# Altium schematic sheet TELEM_IF.SchDoc
size 420 x 297 mm; SheetNumber: 6; PageSetup: Record=PageOptions|CenterHorizontal=False|CenterVertical=False|PrintScale=0.95|XCorrection=0.00|YCorrection=0.00|PrintKind=1|BorderSize=5000000|LeftOffset=0|BottomOffset=0|Orientation=1|PaperLength=1000|PaperWidth=1000|Scale=100|PaperSource=15|PrintQuality=600|MediaType=1|DitherType=10|PaperKind=A4|PrintScaleMode=1
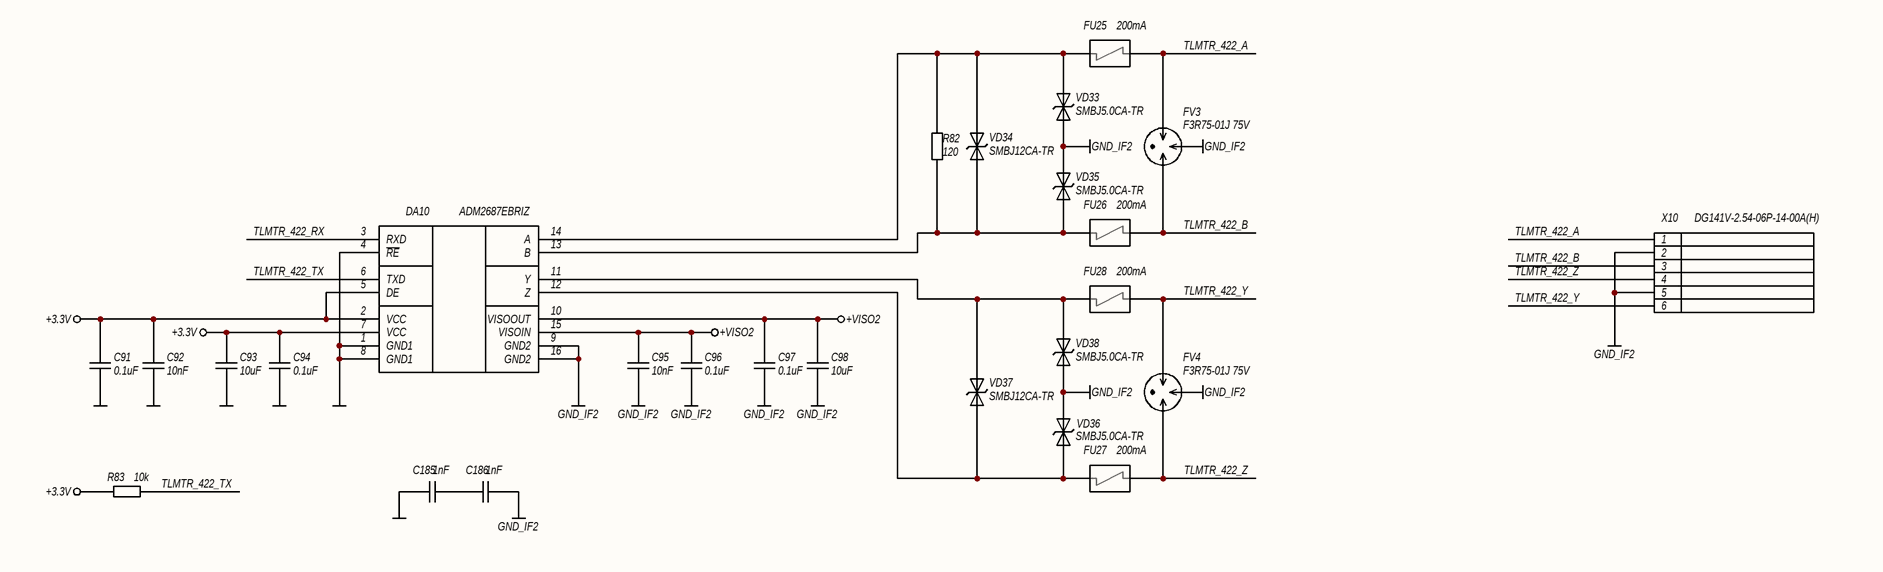
[diagram p0: TELEM_IF.SchDoc]

## Parts
C91  0.1uF  [C0603N]
C92  10nF  [C0603N]
C93  10uF  [C0805N]
C94  0.1uF  [C0603N]
C95  10nF  [C0603N]
C96  0.1uF  [C0603N]
C97  0.1uF  [C0603N]
C98  10uF  [C0805N]
C185  1nF  [C1808N]
C186  1nF  [C1808N]
DA10  ADM2687EBRIZ  [SOIC16_IC]
FU25  200mA  [TBU-CA]
FU26  200mA  [TBU-CA]
FU27  200mA  [TBU-CA]
FU28  200mA  [TBU-CA]
FV3  F3R75-01J 75V  [GDT_3PIN_B2]
FV4  F3R75-01J 75V  [GDT_3PIN_B2]
R82  120  [R0805N]
R83  10k  [R0603N]
VD33  SMBJ5.0CA-TR  [SMB]
VD34  SMBJ12CA-TR  [SMB]
VD35  SMBJ5.0CA-TR  [SMB]
VD36  SMBJ5.0CA-TR  [SMB]
VD37  SMBJ12CA-TR  [SMB]
VD38  SMBJ5.0CA-TR  [SMB]
X10  DG141V-2.54-06P-14-00A(H)  [DG141V-2.54-06P-14-00A(H)]

## Nets
+3.3V: C91.2 C92.1 C93.2 C94.2 DA10.2(VCC) DA10.5(DE) DA10.7(VCC) R83.2
+VISO2: C95.1 C96.2 C97.2 C98.2 DA10.10(VISOOUT) DA10.15(VISOIN)
GND: C91.1 C92.2 C93.1 C94.1 C185.2 DA10.1(GND1) DA10.4(~{RE}) DA10.8(GND1)
GND_IF2: C95.2 C96.1 C97.1 C98.1 C186.1 DA10.9(GND2) DA10.16(GND2) FV3.2 FV4.2 VD33.2(A2) VD35.2(A2) VD36.2(A2) VD38.2(A2) X10.2 X10.5
TLMTR_422_A: FU25.3(IN/OUT) FV3.1 X10.1
TLMTR_422_B: FU26.3(IN/OUT) FV3.3 X10.3
TLMTR_422_RX: DA10.3(RXD)
TLMTR_422_TX: DA10.6(TXD) R83.1
TLMTR_422_Y: FU28.3(IN/OUT) FV4.3 X10.6
TLMTR_422_Z: FU27.3(IN/OUT) FV4.1 X10.4
NetC185_1: C185.1 C186.2
NetDA10_11: DA10.11(Y) FU28.1(IN/OUT) VD37.2(A2) VD38.1(A1)
NetDA10_12: DA10.12(Z) FU27.1(IN/OUT) VD36.1(A1) VD37.1(A1)
NetDA10_13: DA10.13(B) FU26.1(IN/OUT) R82.2 VD34.2(A2) VD35.1(A1)
NetDA10_14: DA10.14(A) FU25.1(IN/OUT) R82.1 VD33.1(A1) VD34.1(A1)

## Notes on the sheet
- Подп. и дата
- Инв. № дубл.
- Взам. инв. №
- Инв. № подл.
- Лист
- Изм.
- № докум.
- Подп.
- Дата
- Копировал
- Формат А3

## Library data of the parts
C91 C94 C96 C97 = CL10B104KB8NNNC: Конденсатор; Точность: 10%; Напряжение: 50V; Диэлектрик: X7R; Производитель: Samsung Electro-Mechanics; Описание: 0.1 µF ±10% 50V Ceramic Capacitor X7R 0603 (1608 Metric); Корпус: 0603 (1608 Metric); Температурный диапазон: -55°C ~ 125°C; Вид монтажа: SMD; Артикул: CL10B104KB8NNNC; Номинал: 0.1uF; Строка для документации: https://mm.digikey.com/Volume0/opasdata/d220001/medias/docus/609/CL10B104KB8NNNC_Spec.pdf; Тип элемента: Конденсатор
C92 C95 = CL10B103KB8NNNC: Конденсатор; Точность: 10%; Напряжение: 16V; Диэлектрик: X7R; Производитель: Samsung Electro-Mechanics; Описание: 10000 pF ±10% 50V Ceramic Capacitor X7R 0603 (1608 Metric); Корпус: 0603 (1608 Metric); Температурный диапазон: -55°C ~ 125°C; Вид монтажа: SMD; Артикул: CL10B103KB8NNNC; Номинал: 10nF; Строка для документации: https://mm.digikey.com/Volume0/opasdata/d220001/medias/docus/609/CL10B103KB8NNNC_Spec.pdf; Тип элемента: Конденсатор
C93 C98 = CL21A106KAYNNNE: Конденсатор; Точность: 10%; Напряжение: 25V; Диэлектрик: X5R; Производитель: Samsung Electro-Mechanics; Описание: 10 µF ±10% 25V Ceramic Capacitor X5R 0805 (2012 Metric); Корпус: 0805 (2012 Metric); Температурный диапазон: -55°C ~ 85°C; Вид монтажа: SMD; Артикул: CL21A106KAYNNNE; Номинал: 10uF; Строка для документации: https://mm.digikey.com/Volume0/opasdata/d220001/medias/docus/5545/CL21A106KAYNNNE%20Spec.pdf; Тип элемента: Конденсатор
C185 C186 = GA342DR7GF102KW02L: Конденсатор; Точность: 10%; Напряжение: 250VAC; Диэлектрик: X7R; Производитель: Murata Electronics; Описание: 1000 pF ±10% 250VAC Ceramic Capacitor X7R 1808 (4520 Metric); Корпус: 1808 (4520 Metric); Температурный диапазон: -55°C ~ 125°C; Вид монтажа: SMD; Артикул: GA342DR7GF102KW02L; Номинал: 1nF; Строка для документации: https://search.murata.co.jp/Ceramy/image/img/A01X/G101/ENG/GA342DR7GF102KW02-01.pdf; Тип элемента: Конденсатор
DA10 = ADM2687EBRIZ: Микросхема интерфейса RS485; Производитель: Analog Devices Inc.; Описание: RS422, RS485 Digital Isolator 5000Vrms 3 Channel 500kbps 25kV/µs CMTI 16-SOIC (0.295", 7.50mm Width); Корпус: 16-SOIC (0.295", 7.50mm Width); Температурный диапазон: -40°C ~ 85°C; Вид монтажа: SMD; Артикул: ADM2687EBRIZ; Строка для документации: https://www.analog.com/media/en/technical-documentation/data-sheets/ADM2682E_2687E.pdf; Тип элемента: Микросхема
FU25-FU28 = TBU-CA065-200-WH: Полупроводниковый предохранитель; Напряжение: 650V; Тип: Surge Suppression IС; Производитель: Bourns Inc.; Описание: SURGE SUPP TBU 200MA 650VIMP SMD; Корпус: 6.50mm x 4.00mm; Температурный диапазон: -55°C ~ 125°C; Вид монтажа: SMD; Артикул: TBU-CA065-200-WH; Ток: 200mA; Строка для документации: https://www.bourns.com/docs/Product-Datasheets/TBU-CA.pdf; Тип элемента: Предохранитель
FV3 FV4 = F3R75-01J 75V: Газовый разрядник, трехвыводный; Ток: 10kA; Тип: Gas Discharge Tube Arresters (GDT); Производитель: ZF; Описание: Gas Discharge Tube 75 V 10000A (10kA) ±25% 3 Pole Through Hole Mount; Корпус: 11.5mm x 7.5mm dia.; Вид монтажа: Through hole; Артикул: F3R75-01J 75V; Напряжение пробоя: 75V; Строка для документации: http://nbruitian.com/show.asp?id=1412; Тип элемента: Газовый разрядник
R82 = RC0805FR-07120RL: Резистор; Точность: 1%; ТКС: ±100ppm/°C; Напряжение: 150V; Производитель: YAGEO; Описание: 120 Ohms ±1% 0.125W, 1/8W Chip Resistor 0805 (2012 Metric) Moisture Resistant Thick Film; Корпус: 0805 (2012 Metric); Температурный диапазон: -55°C ~ 155°C; Вид монтажа: SMD; Артикул: RC0805FR-07120RL; Номинал: 120; Строка для документации: https://www.yageo.com/upload/media/product/productsearch/datasheet/rchip/PYu-RC_Group_51_RoHS_L_12.pdf; Тип элемента: Резистор
R83 = RC0603FR-0710KL: Резистор; Точность: 1%; ТКС: ±100ppm/°C; Напряжение: 75V; Производитель: YAGEO; Описание: 10 kOhms ±1% 0.1W, 1/10W Chip Resistor 0603 (1608 Metric) Moisture Resistant Thick Film; Корпус: 0603 (1608 Metric); Температурный диапазон: -55°C ~ 155°C; Вид монтажа: SMD; Артикул: RC0603FR-0710KL; Номинал: 10k; Строка для документации: https://www.yageo.com/upload/media/product/app/datasheet/rchip/pyu-rc_group_51_rohs_l.pdf; Тип элемента: Резистор
VD33 VD35 VD36 VD38 = SMBJ5.0CA-TR: TVS диод двунаправленный; Напряжение: 5V; Напряжение ограничения: 9.2V; Напряжение пробоя: 6.4V; Ток: 68A; Тип: TVS Bidirectional; Производитель: STMicroelectronics; Описание: 9.2V Clamp 68A Ipp Tvs Diode Surface Mount SMB (DO-214AA); Корпус: DO-214AA, SMB; Температурный диапазон: -55°C ~ 150°C (TJ); Вид монтажа: SMD; Тип элемента: Диод защитный; Артикул: SMBJ5.0CA-TR; Строка для документации: https://www.st.com/content/ccc/resource/technical/document/datasheet/19/78/91/39/07/cd/40/65/CD00001366.pdf/files/CD00001366.pdf/_jcr_content/translations/en.CD00001366.pdf
VD34 VD37 = SMBJ12CA-TR: TVS диод двунаправленный; Напряжение: 12V; Напряжение ограничения: 19.9V; Напряжение пробоя: 13.3V; Ток: 31A; Тип: TVS Bidirectional; Производитель: STMicroelectronics; Описание: 19.9V Clamp 31A Ipp Tvs Diode Surface Mount SMB (DO-214AA); Корпус: DO-214AA, SMB; Температурный диапазон: -55°C ~ 150°C (TJ); Вид монтажа: SMD; Тип элемента: Диод защитный; Артикул: SMBJ12CA-TR; Строка для документации: https://www.st.com/content/ccc/resource/technical/document/datasheet/19/78/91/39/07/cd/40/65/CD00001366.pdf/files/CD00001366.pdf/_jcr_content/translations/en.CD00001366.pdf
X10 = DG141V-2.54-06P-14-00A(H): Разъем, 6 контактов; Тип разъема: Push-Button terminal block; Количество контактов: 6; Шаг контактов: 2.54mm; Ток: 2A; Напряжение: 150V; Производитель: Degson Electronics; Описание: 6 Position Wire to Board Terminal Block Vertical with Board 0.100" (2.54mm) Through Hole; Температурный диапазон: -40°C ~ 105°C; Вид монтажа: Through Hole; Артикул: DG141V-2.54-06P-14-00A(H); Строка для документации: https://static.chipdip.ru/lib/874/DOC000874680.pdf; Тип элемента: Разъем